# EAGLE design BStream_Upcycled (EAGLE 9.6.2)
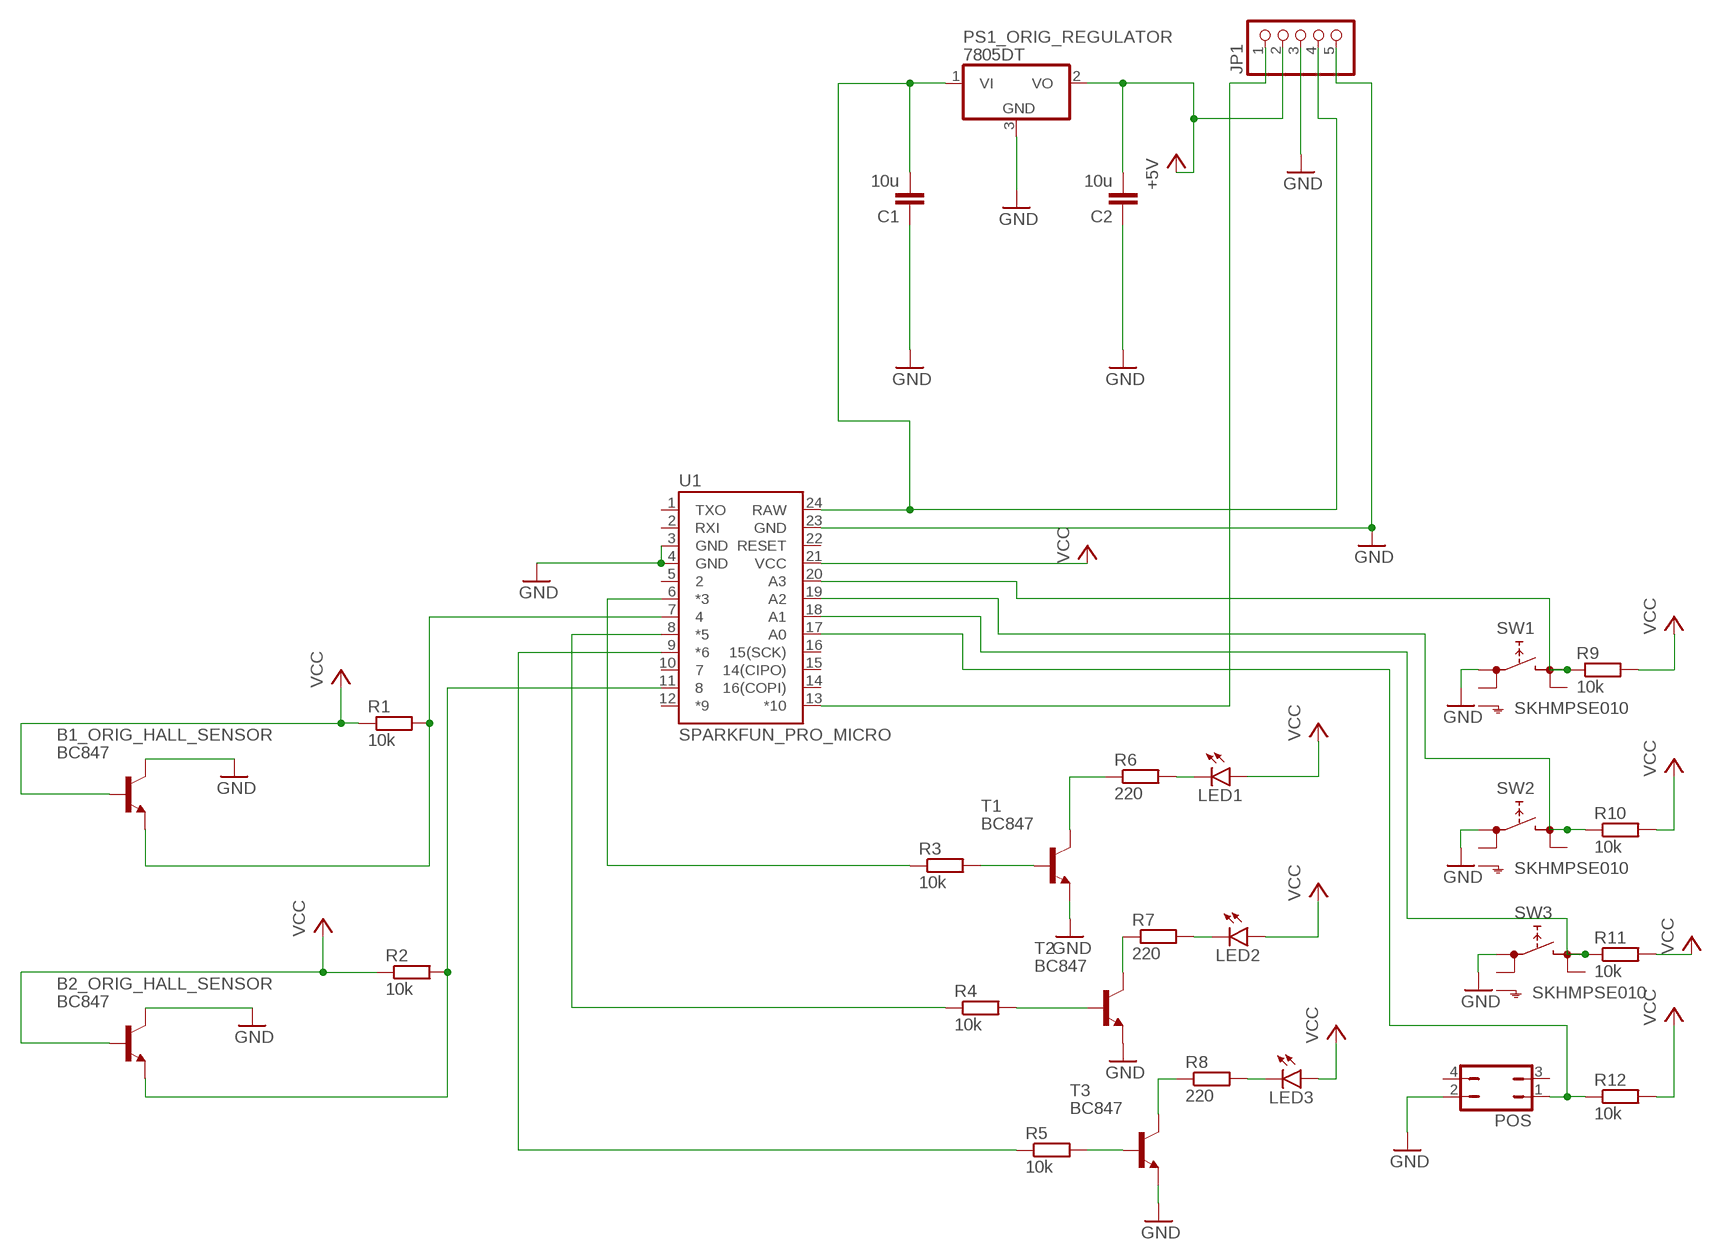
[diagram p0: schematic, sheet 1]

## Parts
B1_ORIG_HALL_SENSOR  BC847  [SOT23]
B2_ORIG_HALL_SENSOR  BC847  [SOT23]
C1  10u  C-EUC1206  [C1206]
C2  10u  C-EUC1206  [C1206]
JP1  PINHD-1X5  [1X05]
LED1  LEDSML1206  [SML1206]
LED2  LEDSML1206  [SML1206]
LED3  LEDSML1206  [SML1206]
POS  JP2Q  [JP2Q]
PS1_ORIG_REGULATOR  7805DT  [TO252]
R1  10k  R-EU_R1206  [R1206]
R2  10k  R-EU_R1206  [R1206]
R3  10k  R-EU_R1206  [R1206]
R4  10k  R-EU_R1206  [R1206]
R5  10k  R-EU_R1206  [R1206]
R6  220  R-EU_R1206  [R1206]
R7  220  R-EU_R1206  [R1206]
R8  220  R-EU_R1206  [R1206]
R9  10k  R-EU_R1206  [R1206]
R10  10k  R-EU_R1206  [R1206]
R11  10k  R-EU_R1206  [R1206]
R12  10k  R-EU_R1206  [R1206]
SW1  SKHMPSE010  [SKHMPXE010]
SW2  SKHMPSE010  [SKHMPXE010]
SW3  SKHMPSE010  [SKHMPXE010]
T1  BC847  [SOT23]
T2  BC847  [SOT23]
T3  BC847  [SOT23]
U1  SPARKFUN_PRO_MICRO  [SPARKFUN_PRO_MICRO]

## Nets
+5V: C2.2 JP1.2 PS1_ORIG_REGULATOR.2(VO)
GND: B1_ORIG_HALL_SENSOR.3(C) B2_ORIG_HALL_SENSOR.3(C) C1.1 C2.1 JP1.3 JP1.5 POS.2 PS1_ORIG_REGULATOR.3(GND) SW1.1(1.1) SW2.1(1.1) SW3.1(1.1) T1.2(E) T2.2(E) T3.2(E) U1.3(GND) U1.4(GND) U1.23(GND)
N$1: R8.1 T3.3(C)
N$2: B1_ORIG_HALL_SENSOR.2(E) R1.2 U1.7
N$3: B2_ORIG_HALL_SENSOR.2(E) R2.2 U1.11
N$4: R3.1 U1.6(*3)
N$5: C1.2 JP1.4 PS1_ORIG_REGULATOR.1(VI) U1.24(RAW)
N$7: R4.1 U1.8(*5)
N$8: JP1.1 U1.13(*10)
N$9: R5.1 U1.9(*6)
N$12: LED1.C R6.2
N$13: LED2.C R7.2
N$14: LED3.C R8.2
N$15: R6.1 T1.3(C)
N$16: R7.1 T2.3(C)
N$18: POS.1 R12.1 U1.17(A0)
N$19: R11.1 SW3.3(2.1) U1.18(A1)
N$20: R10.1 SW2.3(2.1) U1.19(A2)
N$21: R9.1 SW1.3(2.1) U1.20(A3)
N$23: R5.2 T3.1(B)
N$24: R3.2 T1.1(B)
N$25: R4.2 T2.1(B)
VCC: B1_ORIG_HALL_SENSOR.1(B) B2_ORIG_HALL_SENSOR.1(B) LED1.A LED2.A LED3.A R1.1 R2.1 R9.2 R10.2 R11.2 R12.2 U1.21(VCC)
Unconnected: POS.3 POS.4 SW1.2(1.2) SW1.4(2.2) SW1.5(SH) SW2.2(1.2) SW2.4(2.2) SW2.5(SH) SW3.2(1.2) SW3.4(2.2) SW3.5(SH) U1.1(TXO) U1.2(RXI) U1.5 U1.10 U1.12(*9) U1.14(16(COPI)) U1.15(14(CIPO)) U1.16(15(SCK)) U1.22(RESET)

## Library data of the parts
B1_ORIG_HALL_SENSOR B2_ORIG_HALL_SENSOR T1-T3 = transistor:BC847: NPN TRANSISTOR
C1 C2 = rcl:C-EU: CAPACITOR, European symbol; SPICEPREFIX: C
JP1 = pinhead:PINHD-1X5: PIN HEADER
LED1-LED3 = led:LED: LED OSRAM: - CHIPLED LG R971, LG N971, LY N971, LG Q971, LY Q971, LO R971, LY R971 LH N974, LH R974 LS Q976, LO Q976, LY Q976 LO Q996 - Hyper CHIPLED LW Q18S LB Q993, LB Q99A, LB R99A - SideLED LS A670, LO A670, LY A670, LG A670, LP A670 LB A673, LV A673, LT A673, LW A673 LH A674 LY A675 LS A676, LA A676, LO A676, LY A676, LW A676 LS A679, LY A679, LG A679 - Hyper Micro SIDELED® LS Y876, LA Y876, LO Y876, LY Y876 LT Y87S - SmartLED LW L88C, LW L88S LB L89C, LB L89S, LG L890 LS L89K, LO L89K, LY L89K LS L896, LA L896, LO L896, LY L896 - TOPLED LS T670, LO T670, LY T670, LG T670, LP T670 LSG T670, LSP T670, LSY T670, LOP T670, LYG T670 LG T671, LOG T671, LSG T671 LB T673, LV T673, LT T673, LW T673 LH T674 LS T676, LA T676, LO T676, LY T676, LB T676, LH T676, LSB T676, LW T676 LB T67C, LV T67C, LT T67C, LS T67K, LO T67K, LY T67K, LW E67C LS E67B, LA E67B, LO E67B, LY E67B, LB E67C, LV E67C, LT E67C LW T67C LS T679, LY T679, LG T679 LS T770, LO T770, LY T770, LG T770, LP T770 LB T773, LV T773, LT T773, LW T773 LH T774 LS E675, LA E675, LY E675, LS T675 LS T776, LA T776, LO T776, LY T776, LB T776 LHGB T686 LT T68C, LB T68C - Hyper Mini TOPLED® LB M676 - Mini TOPLED Santana® LG M470 LS M47K, LO M47K, LY M47K Source: http://www.osram.convergy.de LUXEON: - LUMILED® LXK2-PW12-R00, LXK2-PW12-S00, LXK2-PW14-U00, LXK2-PW14-V00 LXK2-PM12-R00, LXK2-PM12-S00, LXK2-PM14-U00 LXK2-PE12-Q00, LXK2-PE12-R00, LXK2-PE12-S00, LXK2-PE14-T00, LXK2-PE14-U00 LXK2-PB12-K00, LXK2-PB12-L00, LXK2-PB12-M00, LXK2-PB14-N00, LXK2-PB14-P00, LXK2-PB14-Q00 LXK2-PR12-L00, LXK2-PR12-M00, LXK2-PR14-Q00, LXK2-PR14-R00 LXK2-PD12-Q00, LXK2-PD12-R00, LXK2-PD12-S00 LXK2-PH12-R00, LXK2-PH12-S00 LXK2-PL12-P00, LXK2-PL12-Q00, LXK2-PL12-R00 Source: www.luxeon.com KINGBRIGHT: KA-3528ASYC Source: www.kingbright.com
POS = jumper:JP2Q: JUMPER
PS1_ORIG_REGULATOR = linear:78*: Positive VOLTAGE REGULATOR Source: http://cache.national.com/ds/LM/LM78L05.pdf http://www.fairchildsemi.com/ds/LM/LM7805.pdf
R1-R12 = rcl:R-EU_: RESISTOR, European symbol; SPICEPREFIX: R
SW1-SW3 = switch:SKHMP*E010: 6.2 X 6.5mm TACT Switch (SMD) Source: http://www3.alps.co.jp/WebObjects/catalog.woa/PDF/E/Switch/Tact/SKHM/SKHM.PDF
U1 = SparkFun-Boards:SPARKFUN_PRO_MICRO: SparkFun Pro Micro Atmega32U4 compatible footprint. SparkFun Products: 3.3V/8MHz <https://www.sparkfun.com/products/12587> 5V/16MHz <https://www.sparkfun.com/products/12640>

## Net classes
0 default: width 0.254 mm, drill 0.5 mm, clearance 0.203 mm

## Board
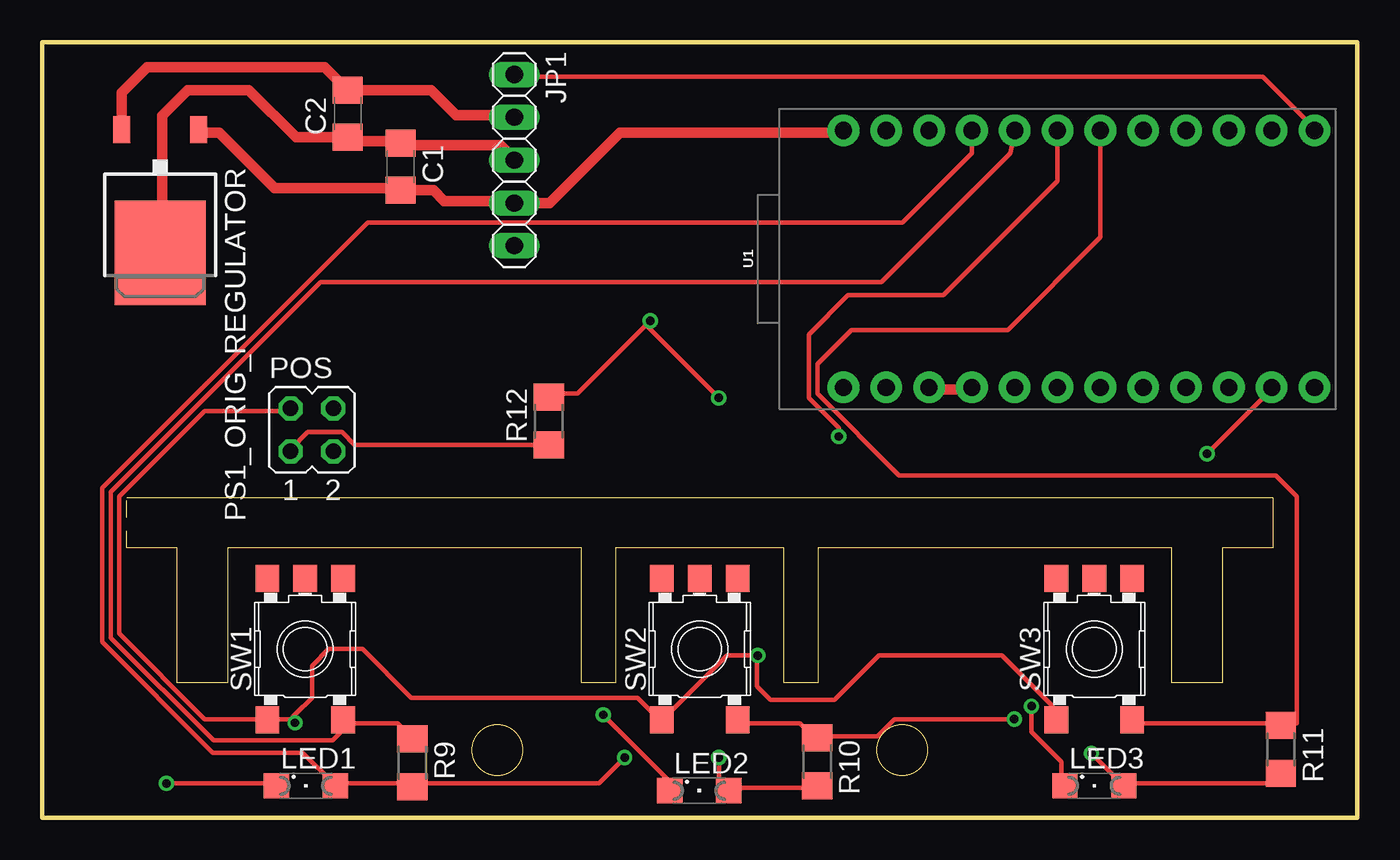
[diagram p1: board, top side]
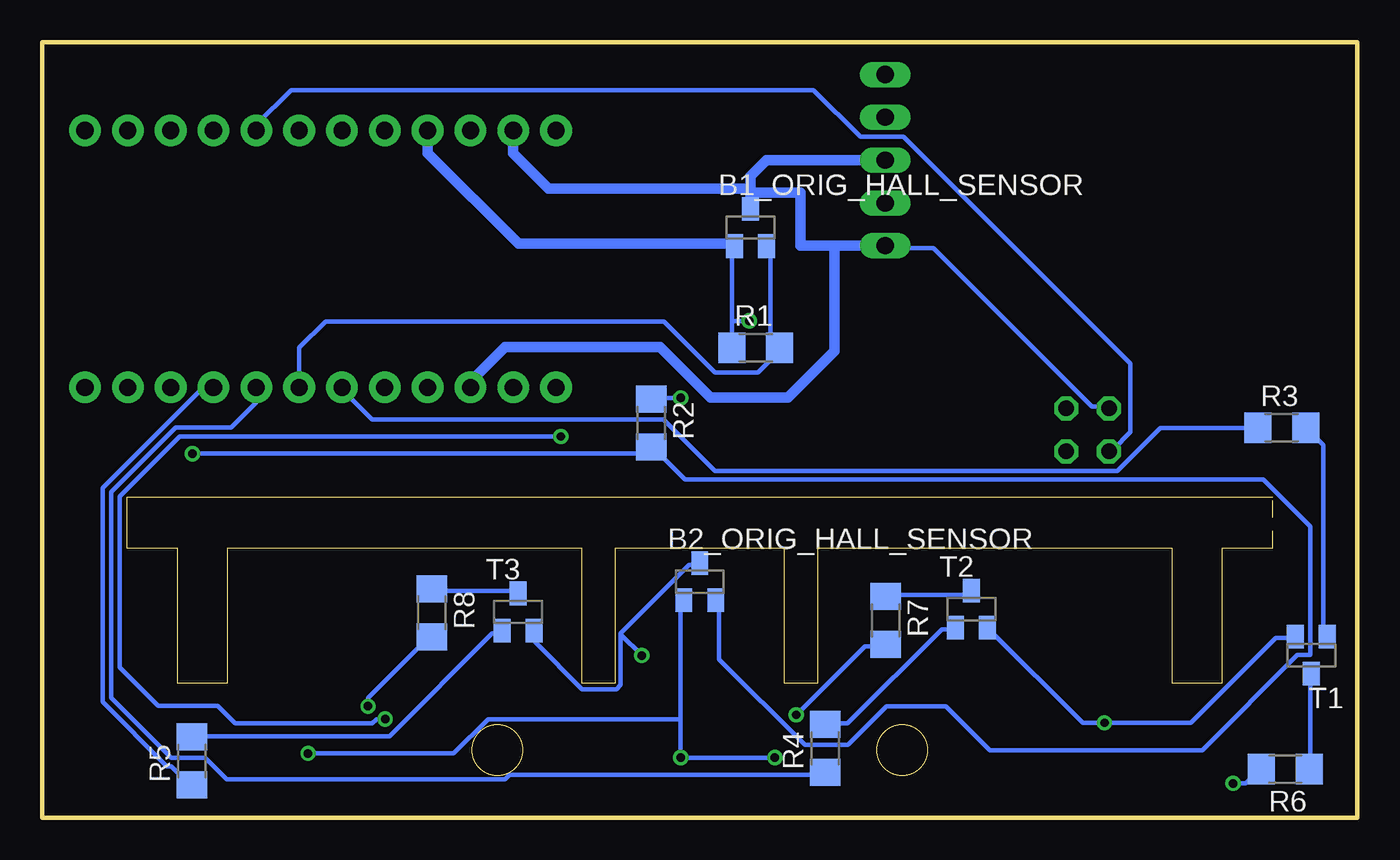
[diagram p2: board, bottom side, seen from below]

Size 78 x 46 mm. Coordinates in mm from the lower left corner, seen from the top.
Outline: 0,0 78,0 78,46 0,46 0,0
Copper layers (1*16): Top 0.035mm / dielectric 0.15mm / Bottom 0.035mm
Design rules "default *": minimum track width 6mil, minimum drill 0.35mm, track to track 10mil, track to pad 10mil, pad to pad 10mil, via to via 10mil, smd to smd 10mil, copper to edge 40mil, drill to drill 6mil, minimum pad ring 10mil, minimum via ring 8mil, stop-mask expansion 4mil, vias tented up to drill 0mil, thermal gap 10mil
tRestrict: area 5,8 to 73,19; area 25.6,2.6 to 28.4,5.4; area 49.6,2.6 to 52.4,5.4
bRestrict: area 5,8 to 73,19; area 49.6,2.6 to 52.4,5.4; area 25.6,2.6 to 28.4,5.4
Milling: area 25.5,2.5 to 28.5,5.5; area 49.5,2.5 to 52.5,5.5; 21 lines

### Footprints (pad centres in the part's own frame; a part is rotated, then mirrored left to right if it is on the bottom)
SOT23 = smd 1 x 1.4: 1 -0.95,-1.1; 2 0.95,-1.1; 3 0,1.1
C1206 = smd 1.6 x 1.8: 1 -1.4,0; 2 1.4,0
1X05 = drill 1.016 long: 1 -5.08,0; 2 -2.54,0; 3 0,0; 4 2.54,0; 5 5.08,0
SML1206 = smd 1.5 x 1.5: A 1.75,0; C -1.75,0
JP2Q = drill 0.914 octagon: 1 -1.27,-1.27; 2 -1.27,1.27; 3 1.27,-1.27; 4 1.27,1.27
TO252 = smd 1 x 1.6: 1 -2.28,-4.8; 2 2.28,-4.8 | smd 5.4 x 6.2: 3 0,2.5
R1206 = smd 1.6 x 1.803: 1 -1.422,0; 2 1.422,0
SKHMPXE010 = smd 1.6 x 1.4: 1 -4.2,2.25; 2 4.2,2.25; 3 -4.2,-2.25; 4 4.2,-2.25; 5 4.2,0
SPARKFUN_PRO_MICRO = drill 1.016 pad 1.88: 1 -7.62,12.7; 2 -7.62,10.16; 3 -7.62,7.62; 4 -7.62,5.08; 5 -7.62,2.54; 6 -7.62,0; 7 -7.62,-2.54; 8 -7.62,-5.08; 9 -7.62,-7.62; 10 -7.62,-10.16; 11 -7.62,-12.7; 12 -7.62,-15.24; 13 7.62,-15.24; 14 7.62,-12.7; 15 7.62,-10.16; 16 7.62,-7.62; 17 7.62,-5.08; 18 7.62,-2.54; 19 7.62,0; 20 7.62,2.54; 21 7.62,5.08; 22 7.62,7.62; 23 7.62,10.16; 24 7.62,12.7

### Placement (x,y rotation side)
B1_ORIG_HALL_SENSOR  36,35 0 bottom
B2_ORIG_HALL_SENSOR  39,14 0 bottom
C1  21.26,38.61 270 top
C2  18.12,41.76 90 top
JP1  28,39 270 top
LED1  15.64,1.89 0 top
LED2  38.97,1.6 0 top
LED3  62.4,1.89 0 top
POS  16,23 0 top
PS1_ORIG_REGULATOR  7,36 180 top
R1  35.68,27.88 0 bottom
R2  41.88,23.4 270 bottom
R3  4.48,23.12 0 bottom
R4  31.56,4.12 90 bottom
R5  69.12,3.36 90 bottom
R6  4.28,2.88 180 bottom
R7  27.97,11.69 270 bottom
R8  54.88,12.15 270 bottom
R9  21.96,3.24 270 top
R10  45.96,3.32 270 top
R11  73.46,4.04 270 top
R12  30.04,23.52 90 top
SW1  15.6,10 90 top
SW2  39,10 90 top
SW3  62.4,10 90 top
T1  2.74,9.64 180 bottom
T2  22.88,12.36 0 bottom
T3  49.78,12.2 0 bottom
U1  60.22,33.14 90 top

### Tracks (layer width: path | path; a pad name or v marks a point on that pad's centre or on a via)
+5V
  Top 0.254: 27.94,41.66 JP1.2
  Top 0.61: PS1_ORIG_REGULATOR.2 4.72,43.01 6.24,44.53 16.75,44.53 C2.2 23.05,43.16 24.56,41.66 27.94,41.66
GND  (via drill 0.5)
  Top 0.254: 15,6.11 16,7.11 16,9 17,10 19,10 21.89,7.11 35.31,7.11 36.58,5.84 SW2.1 36.83,5.84 40.61,9.62 v42.43,9.62 42.4,9.59 42.4,7.8 43.2,7 47,7 49.62,9.62 56.93,9.62 59.94,6.6 59.94,5.84 SW3.1 | 15,6.11 14.73,5.84 13.46,5.84 SW1.1 13.21,5.84 9.65,5.84 4.57,10.92 4.57,19.05 9.65,24.13 14.48,24.13 POS.2 | 15,6.11 v15,5.62 | 18.29,40.13 C2.1 | 21.08,40.13 C1.1 21.34,39.88 | 27.94,39.12 JP1.3 | 52.83,25.4 U1.3 | 55.12,25.4 U1.4 | 7.11,33.53 PS1_ORIG_REGULATOR.3
  Top 0.61: 21.08,40.13 18.29,40.13 | 21.34,39.88 27.18,39.88 27.94,39.12 | 55.12,25.4 52.83,25.4 | 7.11,33.53 7.11,41.64 8.64,43.16 12.26,43.16 15.06,40.36 C2.1
  Bottom 0.254: T1.2 3.81,10.67 4.83,10.67 9.87,5.62 v15,5.62 16.29,5.62 21.84,11.18 T2.2 | 43.69,10.87 43.69,7.87 43.94,7.62 45.97,7.62 48.77,10.41 48.77,10.92 T3.2 | 43.69,10.87 43.69,10.92 39.62,14.99 39.12,14.99 B2_ORIG_HALL_SENSOR.3 | v42.43,9.62 43.69,10.87 | 36,37.07 B1_ORIG_HALL_SENSOR.3 36,37.32 | POS.2 14.73,24.38 15.75,24.38 25.15,33.78 27.94,33.78 JP1.5
  Bottom 0.61: 36,37.07 33.02,37.07 33.02,33.92 31.02,33.92 | 31.02,33.92 JP1.5 | U1.23 50.06,39.42 47.96,37.32 36,37.32 | U1.3 52.6,25.87 50.55,27.92 41.37,27.92 38.35,24.91 33.78,24.91 31.02,27.67 31.02,33.92 | JP1.3 35.06,39 36,38.06 B1_ORIG_HALL_SENSOR.3
N$1
  Bottom 0.254: T3.3 49.78,13.46 54.86,13.46 R8.1
N$2
  Bottom 0.254: B1_ORIG_HALL_SENSOR.2 34.8,33.78 34.8,28.45 34.29,27.94 R1.2 34.29,27.69 35.56,26.42 38.1,26.42 41.12,29.43 61.2,29.43 62.76,27.87 U1.7
N$3  (via drill 0.5)
  Top 0.254: v69.09,21.59 72.9,25.4 U1.11
  Bottom 0.254: B2_ORIG_HALL_SENSOR.2 37.85,12.7 37.85,9.4 32.77,4.32 30.21,4.32 27.92,6.6 24.4,6.6 21.8,4 9.21,4 3.56,9.65 2.79,9.65 2.79,17.27 5.59,20.07 39.88,20.07 41.66,21.84 R2.2 41.91,21.84 42.16,21.59 v69.09,21.59
N$4
  Bottom 0.254: R3.1 6.1,23.11 11.68,23.11 14.22,20.57 38.1,20.57 41.15,23.62 58.42,23.62 60.2,25.4 U1.6
N$5
  Top 0.254: 9.4,40.64 PS1_ORIG_REGULATOR.1 | 21.08,37.34 C1.2 | 27.94,36.58 JP1.4 | 47.5,40.64 U1.24
  Top 0.61: 9.4,40.64 10.49,40.64 13.8,37.34 21.08,37.34 | 27.94,36.58 23.84,36.58 23.21,37.21 C1.2 | 47.5,40.64 34.26,40.64 30.08,36.46 JP1.4
N$7
  Bottom 0.254: U1.8 65.3,24.63 66.8,23.13 70.09,23.13 73.91,19.3 73.91,7.11 70.36,3.56 68.33,3.56 67.06,2.29 50.55,2.29 50.29,2.54 31.75,2.54 R4.1
N$8
  Top 0.254: JP1.1 28.19,43.94 72.39,43.94 75.44,40.89 U1.13
N$9
  Bottom 0.254: R5.1 69.34,2.03 70.36,3.05 70.61,3.05 74.42,6.86 74.42,19.56 68.58,25.4 68.07,25.4 U1.9
N$12  (via drill 0.5)
  Top 0.254: v7.37,2.03 13.72,2.03 LED1.C
  Bottom 0.254: v7.37,2.03 6.6,2.03 5.84,2.79 R6.2
N$13  (via drill 0.5)
  Top 0.254: v33.27,6.1 37.08,2.29 37.08,1.78 LED2.C
  Bottom 0.254: v33.27,6.1 29.21,10.16 28.19,10.16 R7.2
N$14  (via drill 0.5)
  Top 0.254: v58.67,6.6 58.67,5.08 60.45,3.3 60.45,2.03 LED3.C
  Bottom 0.254: v58.67,6.6 58.67,7.11 55.12,10.67 R8.2
N$15
  Bottom 0.254: T1.3 2.79,8.38 2.79,3.05 R6.1
N$16
  Bottom 0.254: T2.3 23.11,13.21 27.94,13.21 R7.1
N$18
  Top 0.254: R12.1 18.54,22.1 17.78,22.86 15.75,22.86 14.73,21.84 POS.1
  Bottom 0.254: U1.17 65.3,41.11 63.25,43.16 32.24,43.16 29.46,40.39 26.92,40.39 13.46,26.92 13.46,22.86 14.48,21.84 POS.1
N$19
  Top 0.254: 73.41,5.59 74.41,5.59 74.41,19.05 73.15,20.3 50.82,20.3 45.97,25.15 45.97,26.91 47.99,28.92 57.26,28.92 62.76,34.42 U1.18 | 73.41,5.59 64.77,5.59 SW3.3 | 73.41,5.59 R11.1
N$20  (via drill 0.5)
  Top 0.254: SW2.3 41.4,5.59 44.96,5.59 45.72,4.83 R10.1 45.97,4.83 49.53,4.83 50.55,5.84 v57.66,5.84 | v47.24,22.61 47.24,23.11 45.47,24.89 45.47,28.67 47.8,31 53.46,31 60.22,37.76 U1.19
  Bottom 0.254: v57.66,5.84 58.17,5.84 58.42,5.59 66.56,5.59 67.6,6.62 71.1,6.62 73.41,8.92 73.41,19.05 69.85,22.61 v47.24,22.61
N$21
  Top 0.254: R9.1 21.84,4.83 21.08,5.59 18.03,5.59 SW1.3 17.85,5.2 17.22,4.57 10.16,4.57 4.06,10.67 4.06,19.3 16.53,31.77 49.78,31.77 57.43,39.42 U1.20
N$23
  Bottom 0.254: T3.1 50.8,10.92 51.31,10.92 57.4,4.83 69.09,4.83 R5.2
N$24
  Bottom 0.254: T1.1 2.03,10.92 2.03,22.1 3.05,23.11 R3.2
N$25
  Bottom 0.254: T2.1 23.88,11.18 24.64,11.18 30.23,5.59 31.5,5.59 R4.2
VCC  (via drill 0.5)
  Top 0.254: 35.81,29.21 31.75,25.15 30.23,25.15 R12.2 | 35.81,29.21 v40.13,24.89 | 35.81,29.21 v36.07,29.46 | R11.2 73.41,2.54 72.9,2.03 64.26,2.03 LED3.A v62.23,3.81 | v40.13,3.56 40.13,2.29 40.64,1.78 LED2.A 40.89,1.78 45.72,1.78 R10.2 | v34.54,3.56 33.02,2.03 22.1,2.03 R9.2 21.84,2.03 17.53,2.03 LED1.A 17.27,2.03 15.46,3.85 10.12,3.85 3.56,10.41 3.56,19.56 19.3,35.31 51.02,35.31 55.14,39.42 U1.21
  Bottom 0.254: 37.08,29.46 37.08,27.94 R1.1 | 37.08,29.46 37.08,33.78 B1_ORIG_HALL_SENSOR.1 37.08,34.04 | 37.08,29.46 v36.07,29.46 | v40.13,24.89 41.66,24.89 R2.1 | 40.13,5.84 v40.13,3.56 v34.54,3.56 | 40.13,5.84 40.13,12.7 B2_ORIG_HALL_SENSOR.1 | v62.23,3.81 53.59,3.81 51.56,5.84 40.13,5.84
  Bottom 0.61: U1.21 55.14,39.42 49.75,34.04 37.08,34.04